# Altium schematic sheet OIS_Patch.SchDoc
size A
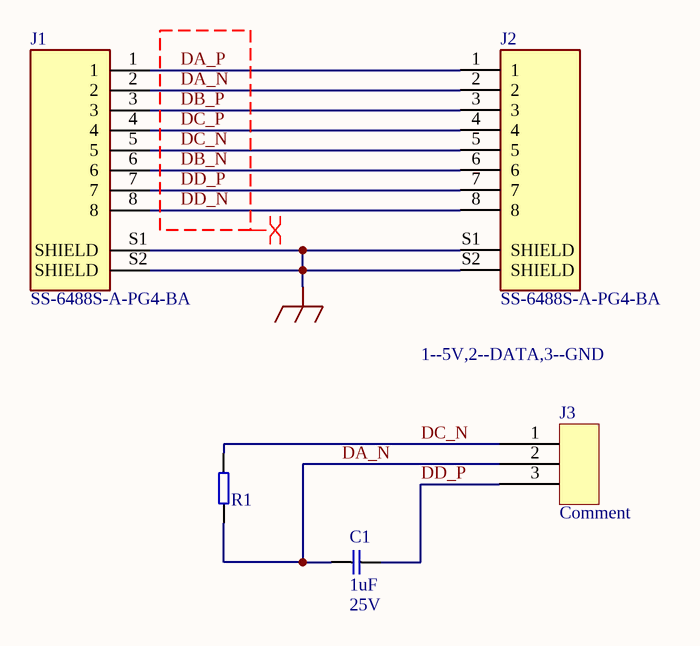
[diagram p0: OIS_Patch.SchDoc]

## Parts
C1  1uF  Voltage: 25V  [C0603]
J1  SS-6488S-A-PG4-BA  [SS-6488S-A-PG4-BA]
J2  SS-6488S-A-PG4-BA  [SS-6488S-A-PG4-BA]
J3  Comment  [2.54_3P]
R1  1K  [R0402]  (value not drawn)

## Nets
FGND: J1.S1(SHIELD) J1.S2(SHIELD) J2.S1(SHIELD) J2.S2(SHIELD)
DA_N: C1.1 J1.2 J2.2 J3.2 R1.1
DA_P: J1.1 J2.1
DB_N: J1.6 J2.6
DB_P: J1.3 J2.3
DC_N: J1.5 J2.5 J3.1 R1.2
DC_P: J1.4 J2.4
DD_N: J1.8 J2.8
DD_P: C1.2 J1.7 J2.7 J3.3

## Layout directives
differential pair: DA_N, DA_P, DB_N, DB_P, DC_N, DC_P, DD_N, DD_P

## Notes on the sheet
- 1--5V,2--DATA,3--GND

## Library data of the parts
C1 = CGA3E1X7R1E105M080AC: CAP CER 1UF 25V X7R 0603; Manufacturer: TDK Corporation; Que: 017; Tolerance: ±20%; Type: Ceramic; Name: Recep Aydin; Part Number: CGA3E1X7R1E105M080AC; Temperature Coefficient: X7R; Package: 0603(1608 Metric); Datasheet: https://product.tdk.com/en/system/files?file=dam/doc/product/capacitor/ceramic/mlcc/catalog/mlcc_automotive_general_en.pdf; Manufacturer Part Number: CGA3E1X7R1E105M080AC
J1 J2 = SS-6488S-A-PG4-BA: Jack Modular Connector 8p8c (RJ45, Ethernet) 90Â° Angle (Right) Shielded, EMI Finger; MF: Bel Fuse; Package: None; Availability: Good; Value: *; MP: SS-6488S-A-PG4-BA; DigiKey-Purchase-URL: https://snapeda.com/shop?store=DigiKey&id=700071; Arrow_Europe-Purchase-URL: https://snapeda.com/shop?store=Arrow+Europe&id=700071; SnapEDA_Link: https://www.snapeda.com/parts/SS-6488S-A-PG4-BA/Stewart%20Connector/view-part/700071/?ref=snap; Price: None; Mouser-Purchase-URL: https://snapeda.com/shop?store=Mouser&id=700071; Check_prices: https://www.snapeda.com/parts/SS-6488S-A-PG4-BA/Stewart%20Connector/view-part/700071/?ref=eda
J3 = CONN_3X2.54: Que: 101; Part Number: CONN_3X2.54
R1 = RT0402BRE071KL: RES SMD 1K OHM 0.1% 1/16W 0402; Manufacturer: Yageo; Que: 015; Name: Recep Aydin; Part Number: RT0402BRE071KL; Tolerance: 0.1%; Resistor Type: Thick Film; Package: 0402; Datasheet: https://www.yageo.com/upload/media/product/productsearch/datasheet/rchip/PYu-RT_1-to-0.01_RoHS_L_12.pdf; Manufacturer Part Number: RT0402BRE071KL